# Altium schematic sheet USB2514 BLOCK DIAGRAM.SchDoc
size A4; DocumentNumber: 1; SheetNumber: 1; SheetTotal: 6
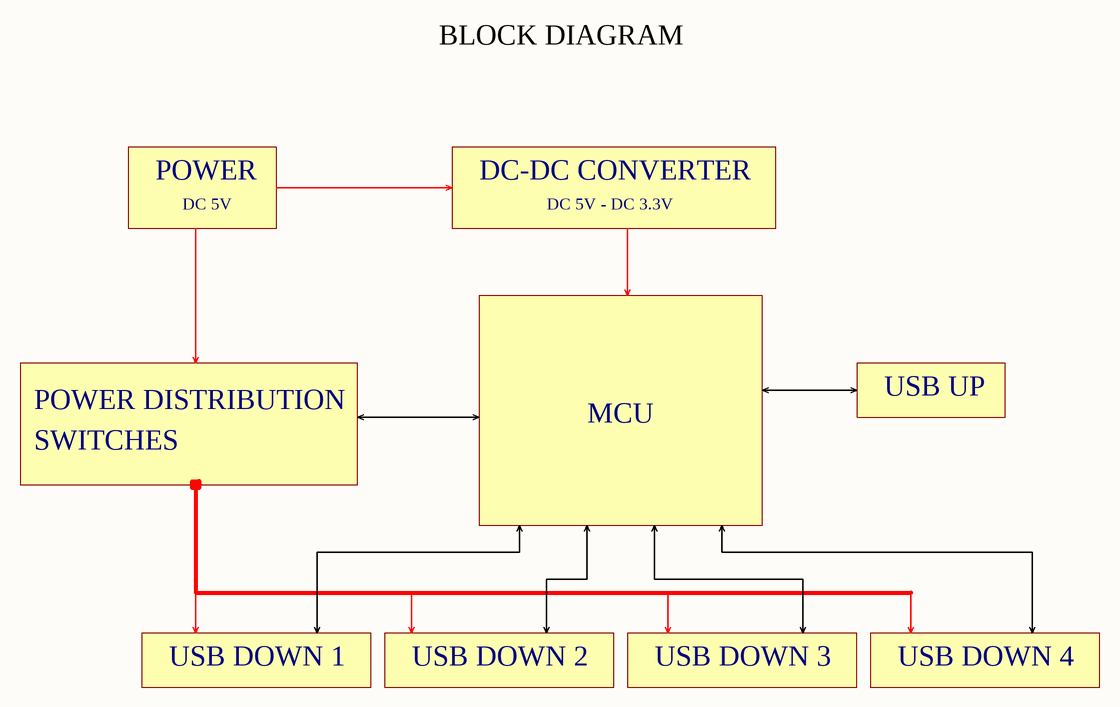
[diagram p0: USB2514 BLOCK DIAGRAM.SchDoc]

## Notes on the sheet
- BLOCK DIAGRAM
- POWER
- DC-DC CONVERTER
- DC 5V
- DC 5V - DC 3.3V
- USB UP
- POWER DISTRIBUTION
- SWITCHES
- MCU
- USB DOWN 1
- USB DOWN 2
- USB DOWN 3
- USB DOWN 4